# Altium schematic sheet DSP.SchDoc: Top Sheet
size A4; Date: 08.04.2017; Author: Jan Petrik; CompanyName: FreeDSP; DrawnBy: Jan Petrik; Organization: FreeDSP; DocumentNumber: 1; SheetNumber: 1; SheetTotal: 16; email: jan_petrik@centrum.cz; license: CC BY-NC 4.0; PageSetup: Record=PageOptions|CenterHorizontal=True|CenterVertical=True|PrintScale=0.97|XCorrection=1.00|YCorrection=1.00|PrintKind=2|BorderSize=5000000|LeftOffset=0|BottomOffset=0|Orientation=2|PaperLength=1000|PaperWidth=1000|Scale=100|PaperSource=7|PrintQuality=-3|MediaType=1|DitherType=10|PrintScaleMode=1|PaperKind=A4|PaperIndex=9; drawing number: blablabla; Version1: N/A; Version2: N/A; Version3: N/A; Change1description: N/A; Change2description: N/A; Change3description: N/A; Change1DrawnBy: N/A; Change2DrawnBy: N/A; Change3DrawnBy: N/A; Change1CheckedBy: N/A; Change2CheckedBy: N/A; Change3CheckedBy: N/A; PreviusVersion_Chng1: N/A; PreviusVersion_Chng2: N/A; PreviusVersion_Chng3: N/A; Variant1description: Standard assembly; Variant2description: N/A; Variant3description: N/A; Variant4description: N/A
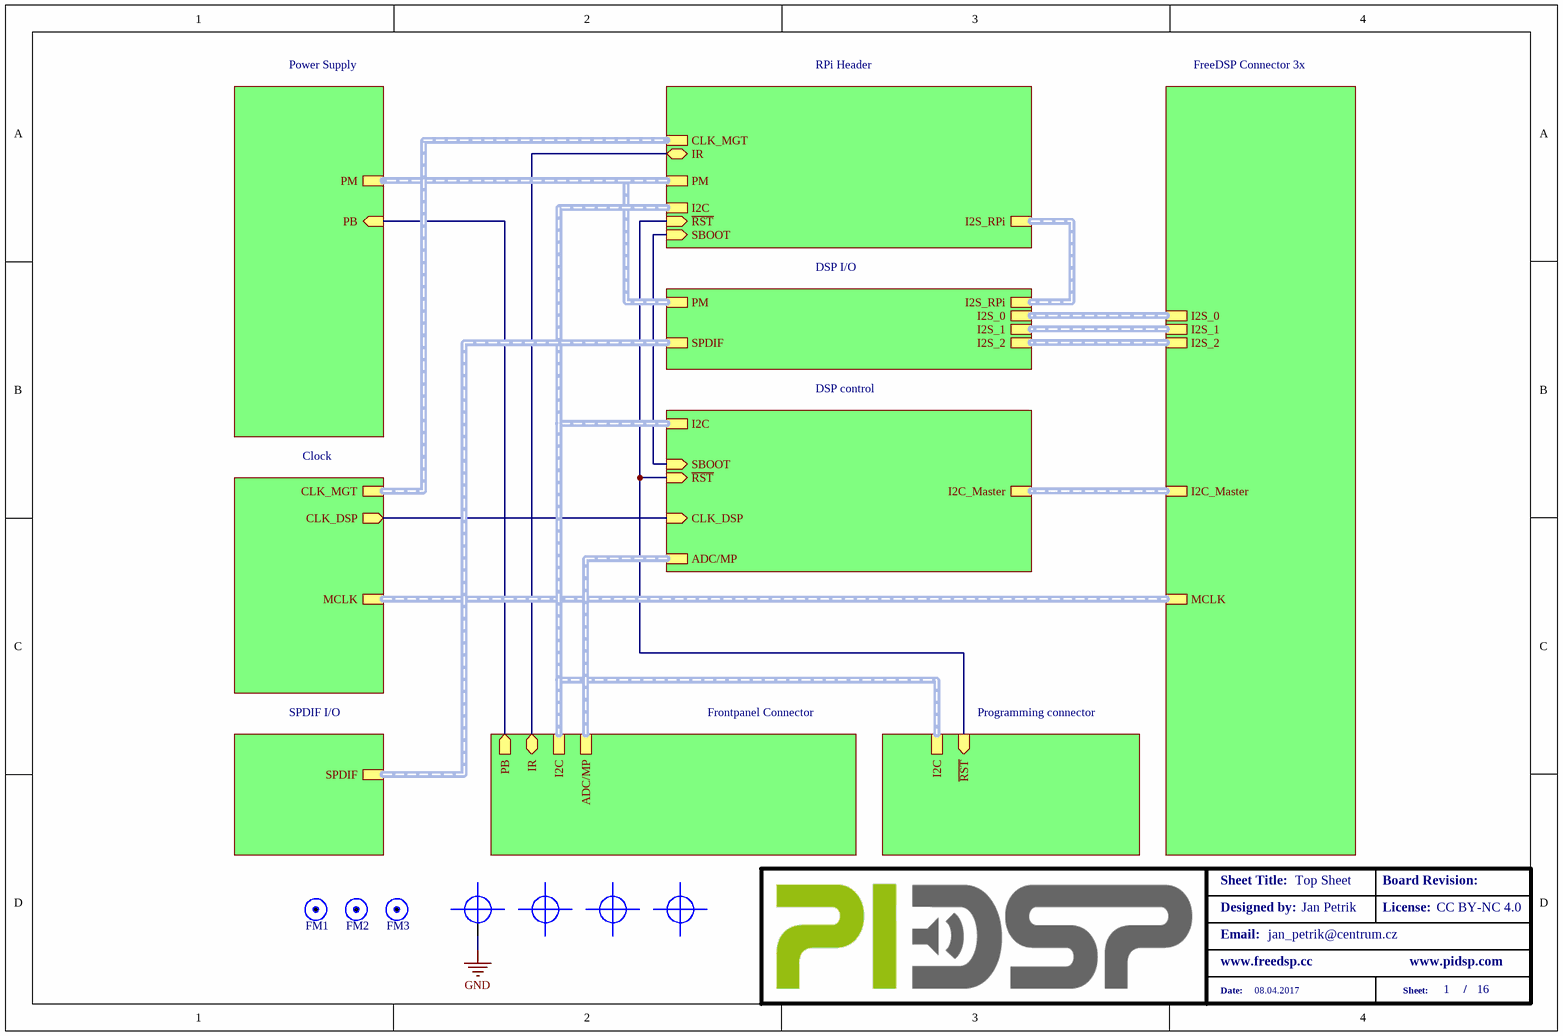
[diagram p0: DSP.SchDoc]

## Parts
FM1  Fiducial Mark Circle  [FM_CIRCLE_BTL]  (value not drawn)  (no BOM)
FM2  Fiducial Mark Circle  [FM_CIRCLE_BTL]  (value not drawn)  (no BOM)
FM3  Fiducial Mark Circle  [FM_CIRCLE_BTL]  (value not drawn)  (no BOM)
H1  M3_PLATED_TIGHT FIT  [HOLE_M3_Plated_TightFit]  (value not drawn)  (no BOM)
H2  M3_TIGHT_FIT  [HOLE_M3_TightFit]  (value not drawn)  (no BOM)
H3  M3_TIGHT_FIT  [HOLE_M3_TightFit]  (value not drawn)  (no BOM)
H4  M3_TIGHT_FIT  [HOLE_M3_TightFit]  (value not drawn)  (no BOM)

## Sub-sheets
Clock = DSPclk.SchDoc: MCLK (harness CLK), CLK_DSP (out), CLK_MGT (harness CLK_MGT)
DSP control = DSPcontrol.SchDoc: I2C_Master (harness I2C), SBOOT (in), ~{RST} (in), ADC/MP (harness ADC/MP), I2C (harness I2C), CLK_DSP (in)
DSP I/O = DSP_DIO.SchDoc: I2S_RPi (harness I2S), I2S_1 (harness I2S), I2S_2 (harness I2S), I2S_0 (harness I2S), PM (harness PM), SPDIF (harness SPDIF)
FreeDSP Connector 3x = IOConn.SchDoc: I2C_Master (harness I2C), I2S_0 (harness I2S), I2S_1 (harness I2S), I2S_2 (harness I2S), MCLK (harness CLK)
Frontpanel Connector = FrontPanelConnector.SchDoc: I2C (harness I2C), IR (bidir), ADC/MP (harness ADC/MP), PB (out)
Power Supply = PowerSupply.SchDoc: PB (in), PM (harness PM)
Programming connector = USBi.SchDoc: ~{RST} (in), I2C (harness I2C)
RPi Header = RPi&MCU.SchDoc: I2C (harness I2C), I2S_RPi (harness I2S), ~{RST} (in), SBOOT (in), IR (bidir), PM (harness PM), CLK_MGT (harness CLK_MGT)
SPDIF I/O = SPDIF.SchDoc: SPDIF (harness SPDIF)

## Nets
GND: H1.1
(unnamed): sheet DSP control/SBOOT, sheet RPi Header/SBOOT
(unnamed): sheet DSP control/~{RST}, sheet RPi Header/~{RST}, sheet Programming connector/~{RST}
(unnamed): sheet DSP control/CLK_DSP, sheet Clock/CLK_DSP
(unnamed): sheet RPi Header/IR, sheet Frontpanel Connector/IR
(unnamed): sheet Power Supply/PB, sheet Frontpanel Connector/PB

Not connected (* = marked no-connect by the designer): H2 #; H3 #; H4 #

## Buses and harness runs
harness sheet Clock/CLK_MGT = sheet RPi Header/CLK_MGT
harness sheet Clock/MCLK = sheet FreeDSP Connector 3x/MCLK
harness sheet DSP control/ADC/MP = sheet Frontpanel Connector/ADC/MP
harness sheet DSP control/I2C = sheet Frontpanel Connector/I2C = sheet Programming connector/I2C = sheet RPi Header/I2C
harness sheet DSP control/I2C_Master = sheet FreeDSP Connector 3x/I2C_Master
harness sheet DSP I/O/I2S_0 = sheet FreeDSP Connector 3x/I2S_0
harness sheet DSP I/O/I2S_1 = sheet FreeDSP Connector 3x/I2S_1
harness sheet DSP I/O/I2S_2 = sheet FreeDSP Connector 3x/I2S_2
harness sheet DSP I/O/I2S_RPi = sheet RPi Header/I2S_RPi
harness sheet DSP I/O/PM = sheet Power Supply/PM = sheet RPi Header/PM
harness sheet DSP I/O/SPDIF = sheet SPDIF I/O/SPDIF

## Notes on the sheet
- Designed by:
- Sheet Title:
- Board Revision:
- License:
- Email:
- www.freedsp.cc
- www.pidsp.com
- Date:
- Sheet:
- /

## Library data of the parts
FM1-FM3 = FIDUCIAL_MARK_CIRCLE_BTL: SMD: 1
H1 = M3_PLATED_TIGHT FIT: M3 mounting hole
H2-H4 = M3_TIGHT_FIT: M3 mounting hole